# Altium schematic sheet PIC32MK.SchDoc
size A4; Organization: Memristor-Robotics; Address1: Vladimira Perića Valtera; Address2: Novi Sad, 21000; Address3: Serbia; SheetNumber: 4; SheetTotal: 11
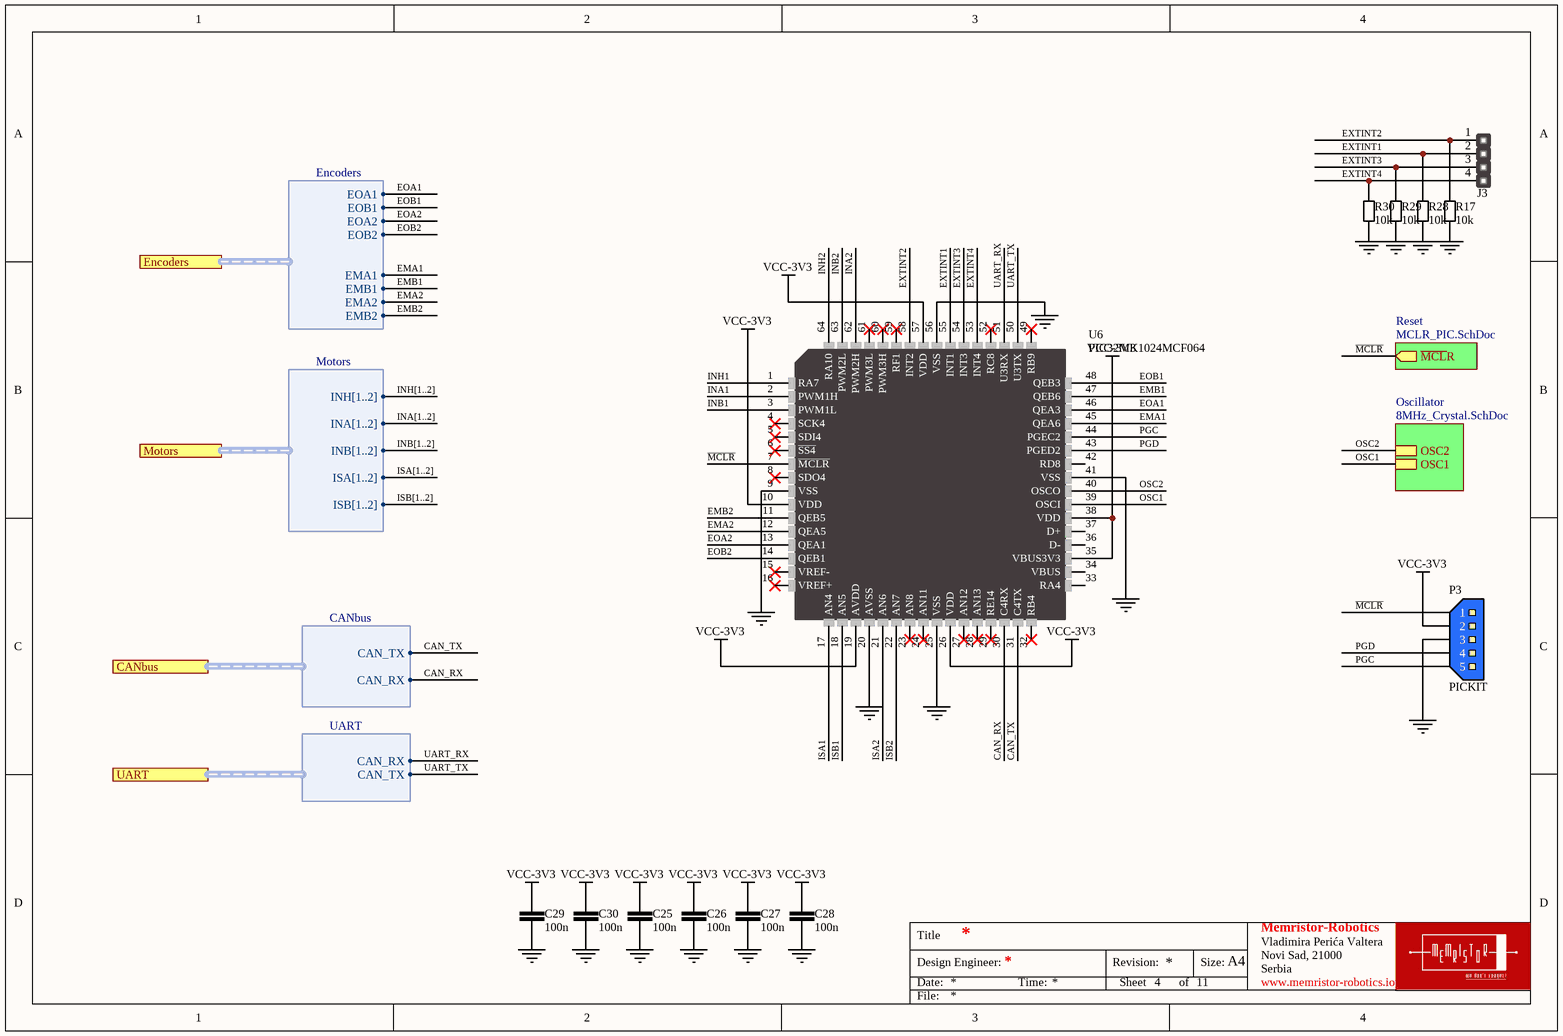
[diagram p0: PIC32MK.SchDoc]

## Parts
C25  100n  [CER_0603]
C26  100n  [CER_0603]
C27  100n  [CER_0603]
C28  100n  [CER_0603]
C29  100n  [CER_0603]
C30  100n  [CER_0603]
J3  EXTINT  [HM1X4]  (value not drawn)
P3  PICKIT  [TE CONNECTIVITY_5PIN_MALE]
R17  10k  [RESC2013X38N-0805-NOOVERLAY]
R28  10k  [RESC2013X38N-0805-NOOVERLAY]
R29  10k  [RESC2013X38N-0805-NOOVERLAY]
R30  10k  [RESC2013X38N-0805-NOOVERLAY]
U6  PIC32MK1024MCF064  [TQFP-64-500um]

## Sub-sheets
Oscillator = 8MHz_Crystal.SchDoc: OSC2, OSC1
Reset = MCLR_PIC.SchDoc: ~{MCL}R (out)

## Ports
CANbus (harness CANbus), Encoders (harness Encoders), Motors (harness Motors), UART (harness UART)

## Harnesses
CANbus: CAN_TX, CAN_RX
UART: CAN_TX, CAN_RX
Encoders: EOA1, EOA2, EMA1, EMA2, EOB1, EOB2, EMB1, EMB2
Motors: INH[1..2], INB[1..2], ISB[1..2], INA[1..2], ISA[1..2]

## Nets
GND: C25.1 C26.1 C27.1 C28.1 C29.1 C30.1 P3.3 R17.1 R28.1 R29.1 R30.1 U6.9(VSS) U6.20(AVSS) U6.25(VSS) U6.41(VSS) U6.56(VSS)
VCC-3V3: C25.2 C26.2 C27.2 C28.2 C29.2 C30.2 P3.2 U6.10(VDD) U6.19(AVDD) U6.26(VDD) U6.35(VBUS3V3) U6.38(VDD) U6.57(VDD)
CAN_RX: U6.30(C4RX) ; port CANbus.CAN_RX
CAN_TX: U6.31(C4TX) ; port CANbus.CAN_TX
EMA1: U6.45(QEA6) ; port Encoders.EMA1
EMA2: U6.12(QEA5) ; port Encoders.EMA2
EMB1: U6.47(QEB6) ; port Encoders.EMB1
EMB2: U6.11(QEB5) ; port Encoders.EMB2
EOA1: U6.46(QEA3) ; port Encoders.EOA1
EOA2: U6.13(QEA1) ; port Encoders.EOA2
EOB1: U6.48(QEB3) ; port Encoders.EOB1
EOB2: U6.14(QEB1) ; port Encoders.EOB2
EXTINT1: J3.2 R28.2 U6.55(INT1)
EXTINT2: J3.1 R17.2 U6.58(INT2)
EXTINT3: J3.3 R29.2 U6.54(INT3)
EXTINT4: J3.4 R30.2 U6.53(INT4)
INA1: U6.2(PWM1H)
INA2: U6.62(PWM2H)
INB1: U6.3(PWM1L)
INB2: U6.63(PWM2L)
INH1: U6.1(RA7)
INH2: U6.64(RA10)
ISA1: U6.17(AN4)
ISA2: U6.21(AN6)
ISB1: U6.18(AN5)
ISB2: U6.22(AN7)
~{MCLR}: P3.1 U6.7(~{MCLR}) ; sheet Reset/~{MCL}R
OSC1: U6.39(OSCI) ; sheet Oscillator/OSC1
OSC2: U6.40(OSCO) ; sheet Oscillator/OSC2
PGC: P3.5 U6.44(PGEC2)
PGD: P3.4 U6.43(PGED2)
UART_RX: U6.51(U3RX) ; port UART.CAN_RX
UART_TX: U6.50(U3TX) ; port UART.CAN_TX

Not connected (* = marked no-connect by the designer): U6 4(SCK4)* 5(SDI4)* 6(~{SS4})* 8(SDO4)* 15(VREF-)* 16(VREF+)* 23(AN8)* 24(AN11)* 27(AN12)* 28(AN13)* 29(RE14)* 32(RB4)* 33(RA4) 34(VBUS) 36(D-) 37(D+) 42(RD8) 49(RB9)* 52(RC8)* 59(RF1)* 60(PWM3H)* 61(PWM3L)*

## Buses and harness runs
bus INA[1..2]
bus INB[1..2]
bus INH[1..2]
bus ISA[1..2]
bus ISB[1..2]

## Notes on the sheet
- Title
- Date:
- Design Engineer:
- Time:
- Revision:
- Sheet
- of
- Size:
- A4
- www.memristor-robotics.io
- File:

## Library data of the parts
C25-C30 = 06032105: CAP CER 100n 10V X5R 10% 0603; Capacitance: 100n
J3 = HEADER_1x4
P3 = TE CONNECTIVITY_5PIN_MALE: BLUE_5PIN_CONECTOR; Manufacturer: TE CONNECTIVITY / AMP; Manufacturer Part Number 1: 281695-3; Order Code 1: 1205983; Price 1: £0.403; Supplier 1: uk.farnell.com
R17 R28-R30 = 000001002: RES SMD 10 kOhm 1/8W 0805; Resistance: 10k
U6 = PIC32MK1024MCF064: IC MCU 32BIT 1MB FLASH 64TQFP; Manufacturer Part Number: PIC32MK1024MCF064